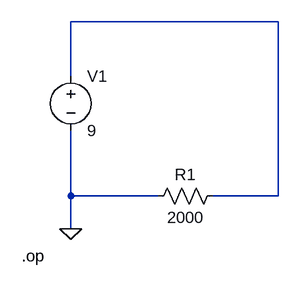
[diagram p0: schematic 1_Analysis_of_a_simple_resistive_circuit.asc]
1_Analysis_of_a_simple_resistive_circuit.asc, the LTspice schematic file:
Version 4.1
SHEET 1 880 680
WIRE 448 96 144 96
WIRE 144 176 144 96
WIRE 144 352 144 256
WIRE 272 352 144 352
WIRE 448 352 448 96
WIRE 448 352 352 352
WIRE 144 400 144 352
FLAG 144 400 0
DATAFLAG 368 352 ""
DATAFLAG 144 384 ""
DATAFLAG 144 112 ""
SYMBOL voltage 144 160 R0
WINDOW 123 0 0 Left 0
WINDOW 39 0 0 Left 0
SYMATTR InstName V1
SYMATTR Value 9
SYMBOL res 368 336 R90
WINDOW 0 0 56 VBottom 2
WINDOW 3 32 56 VTop 2
SYMATTR InstName R1
SYMATTR Value 2000
TEXT 72 440 Left 2 !.op

The netlist it stands for:
* 1_Analysis_of_a_simple_resistive_circuit.asc
V1 N001 0 9
R1 N001 0 2000
.op
.backanno
.end